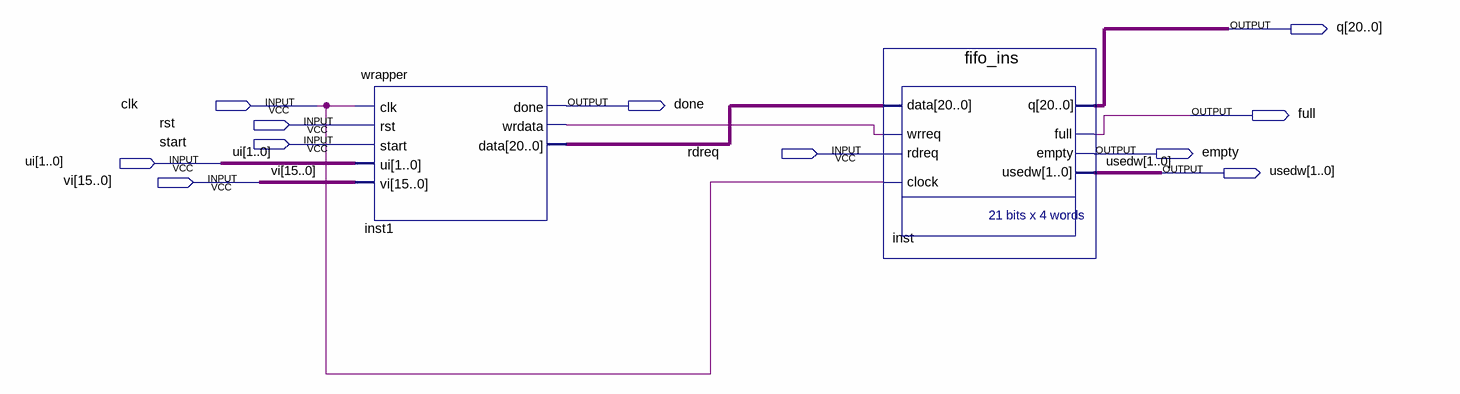
[diagram p0: schematic sheet]
// Quartus schematic wrapper_fifo.bdf as structural Verilog: 2 symbols, 11 pins
module wrapper_fifo (
  input  clk,
  input  rst,
  input  start,
  input  rdreq,
  input  [1:0] ui,
  input  [15:0] vi,
  output [20:0] q,
  output done,
  output full,
  output empty,
  output [1:0] usedw
);

  wire inst1_wrdata;
  wire [20:0] inst1_data;

  wrapper inst1 (
    .clk(clk), .rst(rst), .start(start), .ui(ui), .vi(vi), .done(done), .wrdata(inst1_wrdata),
    .data(inst1_data));
  fifo_ins inst (
    .data(inst1_data), .wrreq(inst1_wrdata), .rdreq(rdreq), .clock(clk), .q(q), .full(full), .empty(empty),
    .usedw(usedw));
endmodule
